# EAGLE design FLEX_CONN (EAGLE 9.5.2)
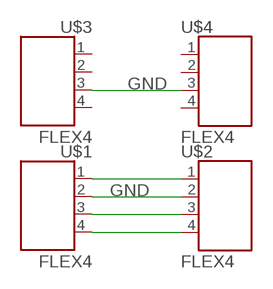
[diagram p0: schematic, sheet 1]

## Parts
U$1  FLEX4  [FLEX4]
U$2  FLEX4  [FLEX4]
U$3  FLEX4  [FLEX4]
U$4  FLEX4  [FLEX4]

## Nets
GND: U$1.2 U$2.2 U$3.3 U$4.3
N$1: U$1.1 U$2.1
N$3: U$1.3 U$2.3
N$4: U$1.4 U$2.4
Unconnected: U$3.1 U$3.2 U$3.4 U$4.1 U$4.2 U$4.4

## Library data of the parts
U$1-U$4 = Flex4:FLEX4

## Board
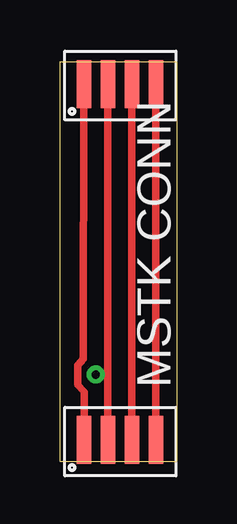
[diagram p1: board, top side]
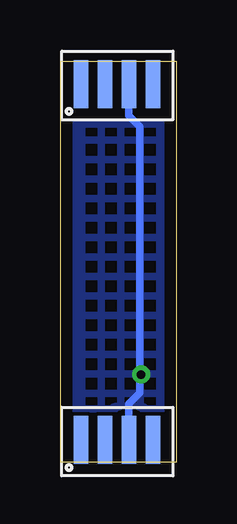
[diagram p2: board, bottom side, seen from below]

Size 4.87 x 16.7 mm. Coordinates in mm from the lower left corner, seen from the top.
Outline: 4.87,0 0,0 0,16.7 4.87,16.7 4.87,0
Copper layers (1*16): Top 0.035mm / dielectric 1.5mm / Bottom 0.035mm
Design rules "default *": minimum track width 6mil, minimum drill 0.35mm, track to track 6mil, track to pad 6mil, pad to pad 6mil, via to via 6mil, smd to smd 6mil, copper to edge 20mil, drill to drill 6mil, minimum pad ring 10mil, minimum via ring 8mil, stop-mask expansion 4mil, vias tented up to drill 0mil, thermal gap 10mil

### Footprints (pad centres in the part's own frame; a part is rotated, then mirrored left to right if it is on the bottom)
FLEX4 = smd 0.6 x 2: 1 -3.77,1.52; 2 -2.77,1.52; 3 -1.77,1.52; 4 -0.77,1.52

### Placement (x,y rotation side)
U$1  4.77,-0.6 0 top
U$2  4.77,14.25 0 top
U$3  0.23,-0.6 0 bottom
U$4  0.23,14.25 0 bottom

### Tracks (layer width: path | path; a pad name or v marks a point on that pad's centre or on a via)
GND  (via drill 0.35)
  Top 0.305: U$3.3 2,3.65 | 2,3.65 U$4.3 | v1.49,3.65 2,3.65
  Bottom 0.305: U$3.3 2,2.42 1.54,2.87 1.54,3.64 | U$4.3 2,14.45 1.54,13.99 1.54,3.65 v1.49,3.65
  pour Bottom (hatched): 0.01,1.97 5.38,1.97 5.38,14.08 0.01,14.08
N$1
  Top 0.305: 0.89,15.66 U$2.1 0.98,4.29 0.75,4.03 0.75,3.24 1,2.9 U$1.1 0.89,1.03
N$3
  Top 0.305: U$1.3 U$2.3
N$4
  Top 0.305: U$1.4 U$2.4

### Text on the board
tNames: MSTK CONN
Document: Stiffener TOP